# Altium schematic sheet BeagleBoneCape.SchDoc
size A
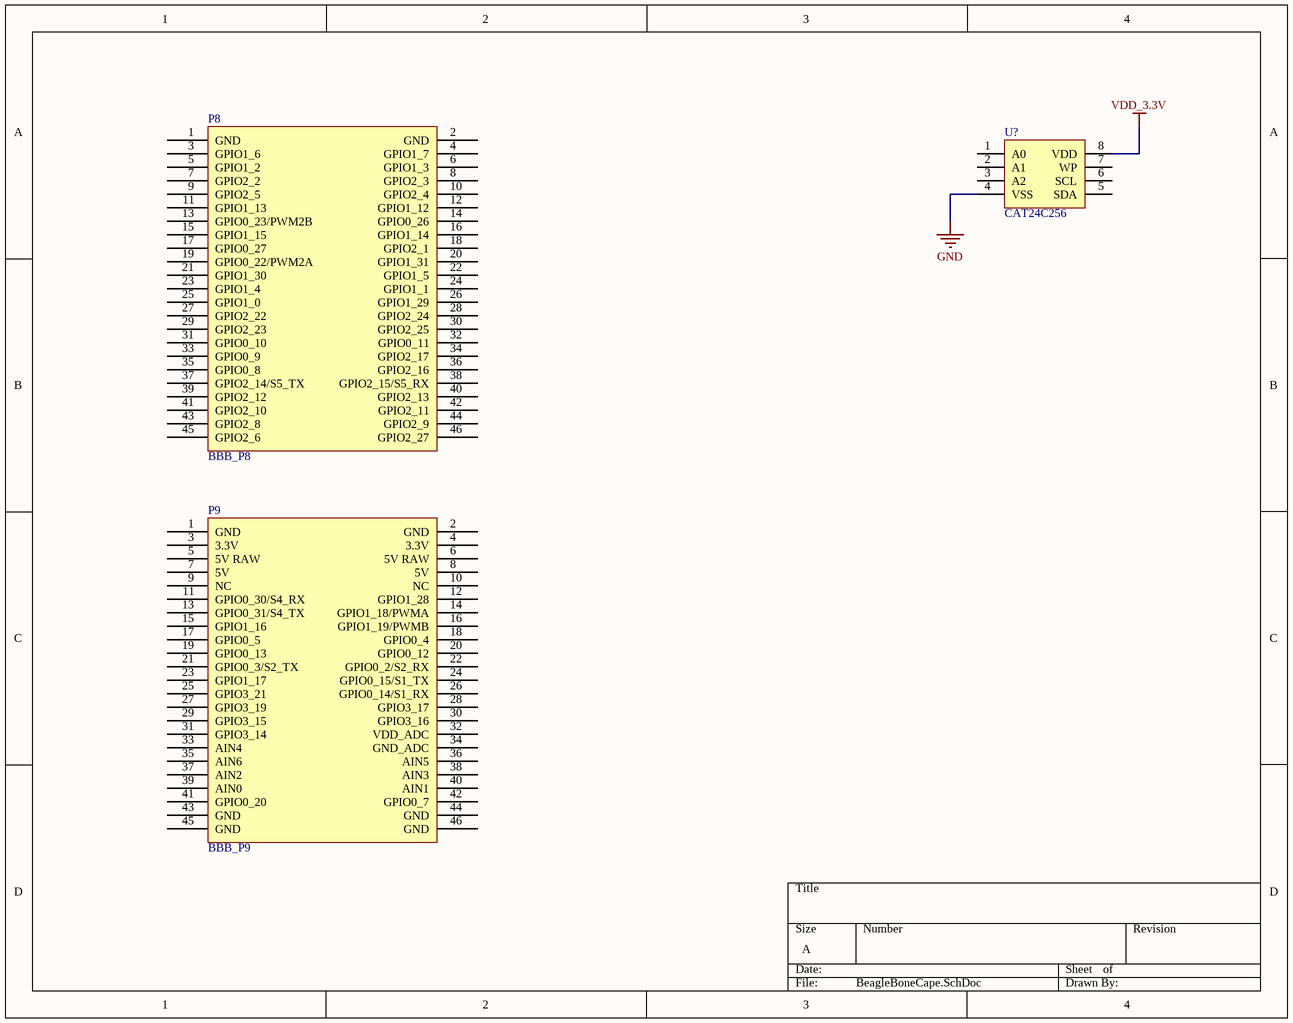
[diagram p0: BeagleBoneCape.SchDoc]

## Parts
P8  BBB_P8  [BBB_CAPE_HEADER]
P9  BBB_P9  [BBB_CAPE_HEADER]
U?  CAT24C256  [SOIC-8]

## Nets
GND: U?.4(VSS)
VDD_3.3V: U?.8(VDD)

Not connected (* = marked no-connect by the designer): P8 1(GND) 2(GND) 3(GPIO1_6) 4(GPIO1_7) 5(GPIO1_2) 6(GPIO1_3) 7(GPIO2_2) 8(GPIO2_3) 9(GPIO2_5) 10(GPIO2_4) 11(GPIO1_13) 12(GPIO1_12) 13(GPIO0_23/PWM2B) 14(GPIO0_26) 15(GPIO1_15) 16(GPIO1_14) 17(GPIO0_27) 18(GPIO2_1) 19(GPIO0_22/PWM2A) 20(GPIO1_31) 21(GPIO1_30) 22(GPIO1_5) 23(GPIO1_4) 24(GPIO1_1) 25(GPIO1_0) 26(GPIO1_29) 27(GPIO2_22) 28(GPIO2_24) 29(GPIO2_23) 30(GPIO2_25) 31(GPIO0_10) 32(GPIO0_11) 33(GPIO0_9) 34(GPIO2_17) 35(GPIO0_8) 36(GPIO2_16) 37(GPIO2_14/S5_TX) 38(GPIO2_15/S5_RX) 39(GPIO2_12) 40(GPIO2_13) 41(GPIO2_10) 42(GPIO2_11) 43(GPIO2_8) 44(GPIO2_9) 45(GPIO2_6) 46(GPIO2_27); P9 1(GND) 2(GND) 3(3.3V) 4(3.3V) 5(5V_RAW) 6(5V_RAW) 7(5V) 8(5V) 9(NC) 10(NC) 11(GPIO0_30/S4_RX) 12(GPIO1_28) 13(GPIO0_31/S4_TX) 14(GPIO1_18/PWMA) 15(GPIO1_16) 16(GPIO1_19/PWMB) 17(GPIO0_5) 18(GPIO0_4) 19(GPIO0_13) 20(GPIO0_12) 21(GPIO0_3/S2_TX) 22(GPIO0_2/S2_RX) 23(GPIO1_17) 24(GPIO0_15/S1_TX) 25(GPIO3_21) 26(GPIO0_14/S1_RX) 27(GPIO3_19) 28(GPIO3_17) 29(GPIO3_15) 30(GPIO3_16) 31(GPIO3_14) 32(VDD_ADC) 33(AIN4) 34(GND_ADC) 35(AIN6) 36(AIN5) 37(AIN2) 38(AIN3) 39(AIN0) 40(AIN1) 41(GPIO0_20) 42(GPIO0_7) 43(GND) 44(GND) 45(GND) 46(GND); U? 1(A0) 2(A1) 3(A2) 5(SDA) 6(SCL) 7(WP)